# EAGLE design breakout (EAGLE 5.11)
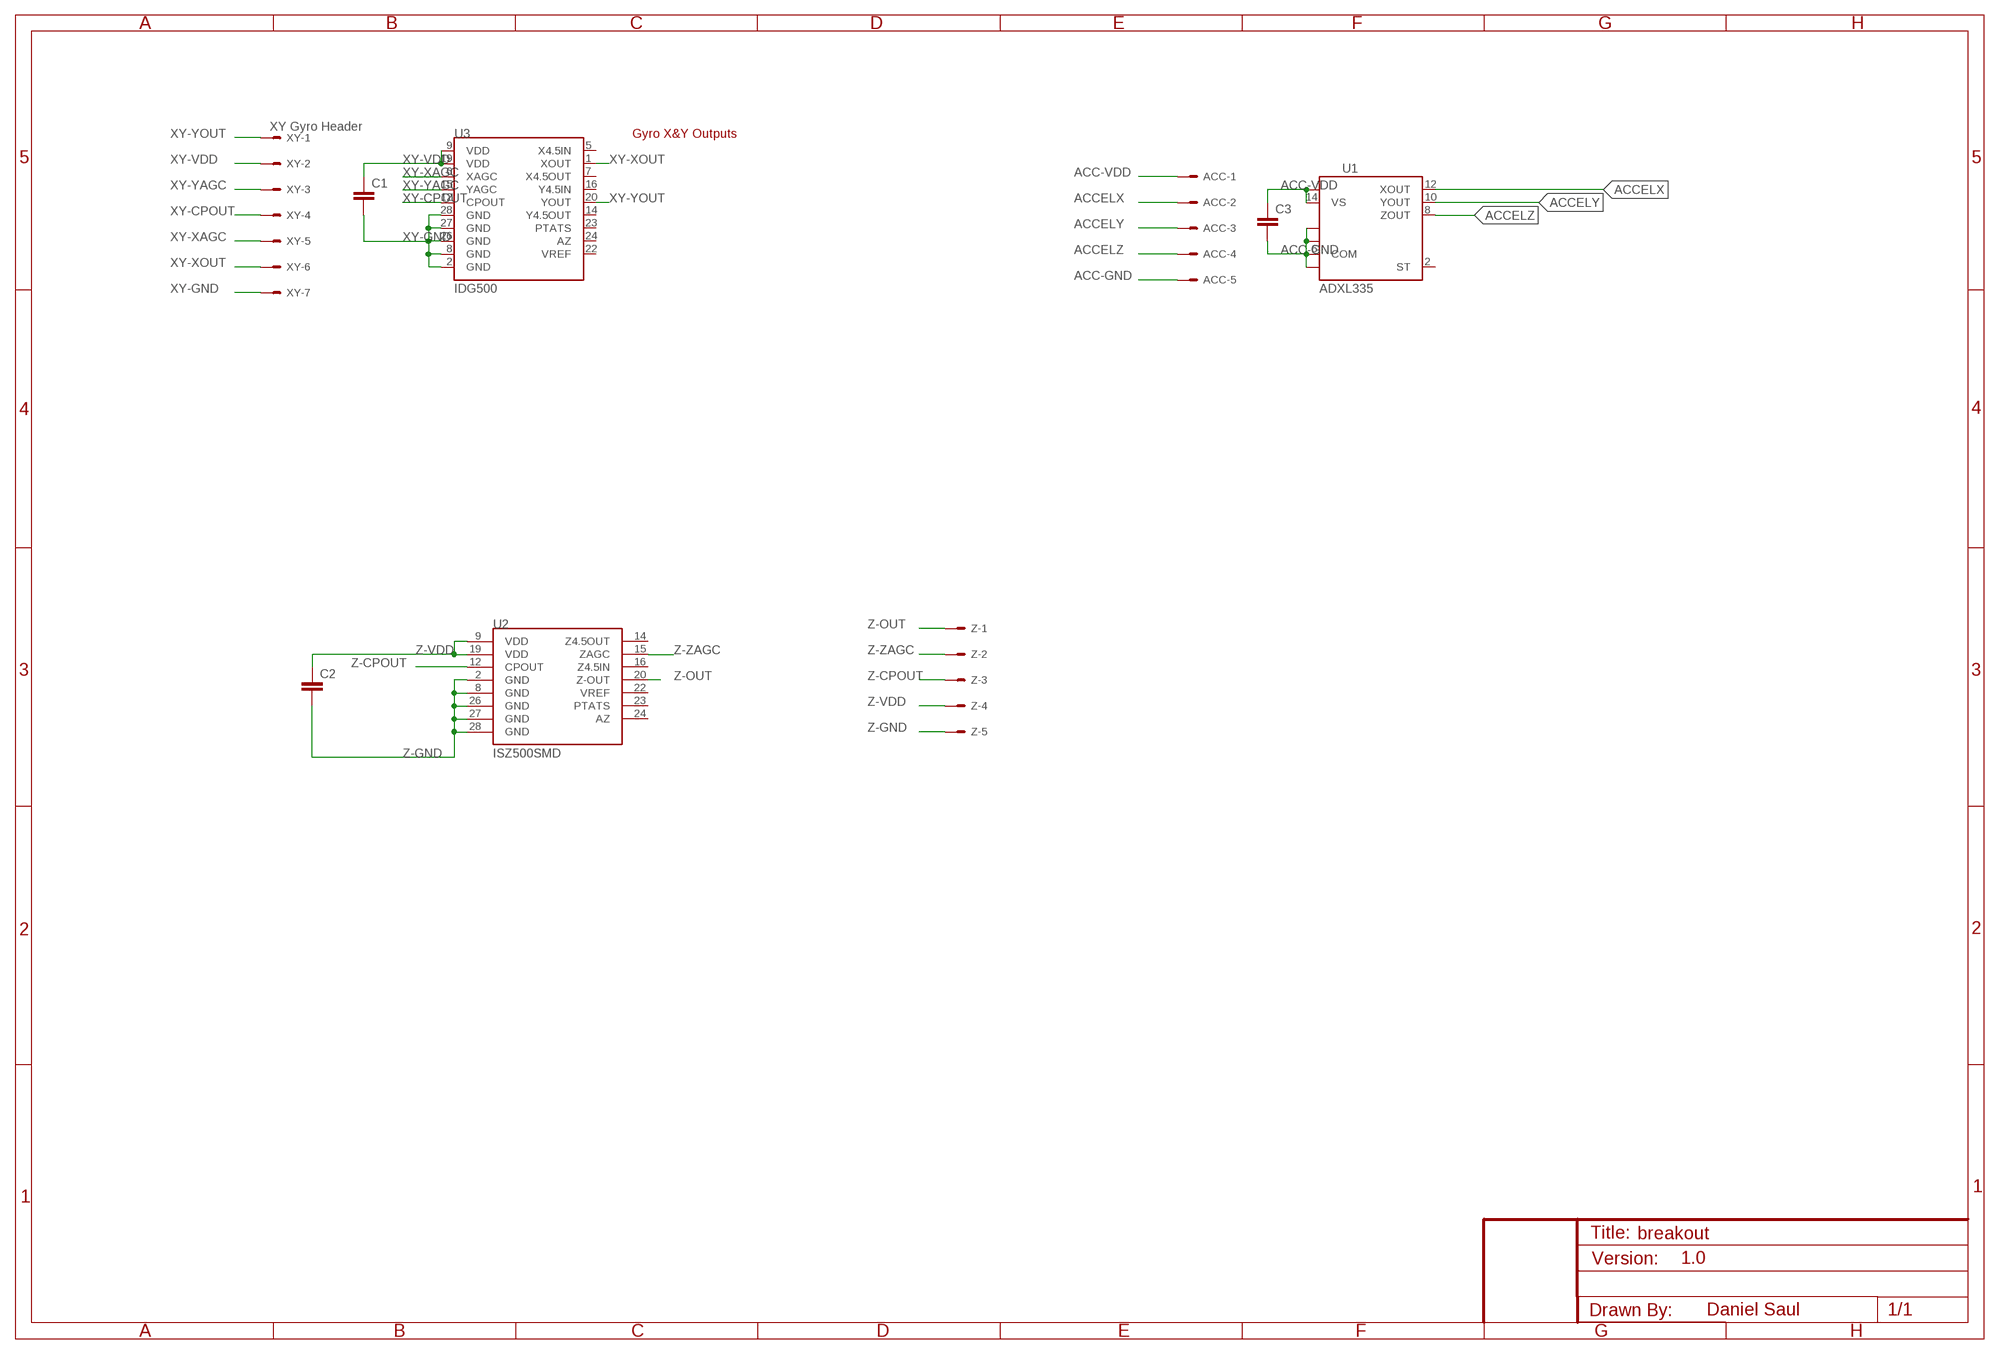
[diagram p0: schematic, sheet 1]

## Parts
ACC  22-27-2051-05  [6410-05]
C1  CAP0805  [0805]
C2  CAP0805  [0805]
C3  CAP0805  [0805]
U1  ADXL335  [LFCSP-16]
U2  ISZ500SMD  [QFN-28_6X8]
U3  IDG500  [SPARKFUN_IDG500]
XY  XY Gyro Header  22-27-2071-07  [6410-07]
Z  22-27-2051-05  [6410-05]

## Nets
ACC-GND: ACC.5 C3.2 U1.3(COM) U1.5(COM) U1.6(COM) U1.7(COM)
ACC-VDD: ACC.1 C3.1 U1.14(VS) U1.15(VS)
ACCELX: ACC.2 U1.12(XOUT)
ACCELY: ACC.3 U1.10(YOUT)
ACCELZ: ACC.4 U1.8(ZOUT)
XY-CPOUT: U3.12(CPOUT) XY.4
XY-GND: C1.2 U3.2(GND) U3.8(GND) U3.26(GND) U3.27(GND) U3.28(GND) XY.7
XY-VDD: C1.1 U3.9(VDD) U3.19(VDD) XY.2
XY-XAGC: U3.6(XAGC) XY.5
XY-XOUT: U3.1(XOUT) XY.6
XY-YAGC: U3.15(YAGC) XY.3
XY-YOUT: U3.20(YOUT) XY.1
Z-CPOUT: U2.12(CPOUT) Z.3
Z-GND: C2.2 U2.2(GND) U2.8(GND) U2.26(GND) U2.27(GND) U2.28(GND) Z.5
Z-OUT: U2.20(Z-OUT) Z.1
Z-VDD: C2.1 U2.9(VDD) U2.19(VDD) Z.4
Z-ZAGC: U2.15(ZAGC) Z.2
Unconnected: U1.2(ST) U2.14(Z4.5OUT) U2.16(Z4.5IN) U2.22(VREF) U2.23(PTATS) U2.24(AZ) U3.5(X4.5IN) U3.7(X4.5OUT) U3.14(Y4.5OUT) U3.16(Y4.5IN) U3.22(VREF) U3.23(PTATS) U3.24(AZ)

## Notes on the sheet
- Gyro X&Y Outputs
- 1.0
- Daniel Saul

## Library data of the parts
ACC Z = con-molex:22-?-05: CONNECTOR wire to board 2.54 mm (.1 inch) pitch header; OC_FARNELL: unknown; OC_NEWARK: unknown
C1-C3 = SparkFun:CAP: Capacitor Standard 0603 ceramic capacitor, and 0.1" leaded capacitor.
U1 = SparkFun:ADXL335
U2 = SparkFun:ISZ500: ISZ500 Single axis gyro
U3 = SparkFun:IDG500
XY = con-molex:22-?-07: CONNECTOR wire to board 2.54 mm (.1 inch) pitch header; OC_FARNELL: unknown; OC_NEWARK: unknown

## Board
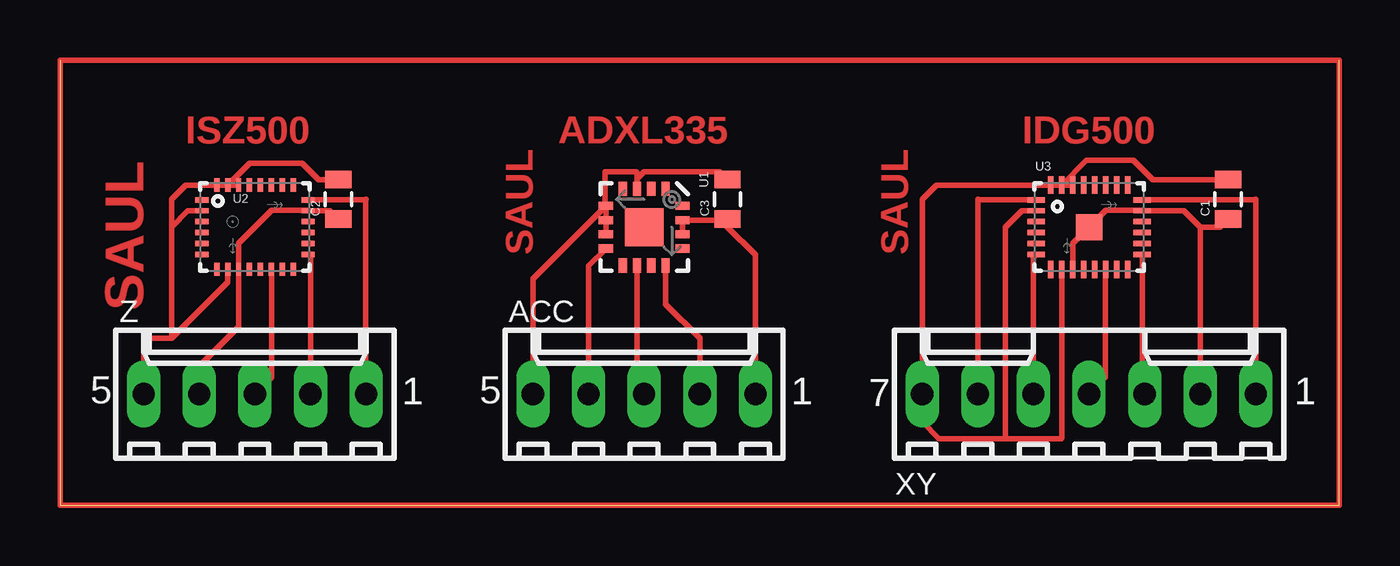
[diagram p1: board, top side]

Size 58.42 x 20.32 mm. Coordinates in mm from the lower left corner, seen from the top.
Outline: 58.42,20.32 58.42,0 0,0 0,20.32
Copper layers (1*16): Top 0.035mm / dielectric 1.5mm / Bottom 0.035mm
Design rules "Fusion_eagle_rule_v1.1 *": minimum track width 10mil, minimum drill 12mil, track to track 10mil, track to pad 6mil, pad to pad 6mil, via to via 6mil, smd to smd 0mil, copper to edge 10mil, drill to drill 10mil, minimum pad ring 10mil, minimum via ring 6mil, stop-mask expansion 2mil, vias tented up to drill 100mil, thermal gap 10mil

### Footprints (pad centres in the part's own frame; a part is rotated, then mirrored left to right if it is on the bottom)
6410-05 = drill 1.016 long: 1 5.08,0; 2 2.54,0; 3 0,0; 4 -2.54,0; 5 -5.08,0
0805 = smd 0.8 x 1.2: 1 -0.9,0; 2 0.9,0
LFCSP-16 = smd 1.75 x 1.75: 0 0,0 | smd 0.65 x 0.37: 1 -1.75,0.975; 2 -1.75,0.325; 3 -1.75,-0.325; 4 -1.75,-0.975; 9 1.75,-0.975; 10 1.75,-0.325; 11 1.75,0.325; 12 1.75,0.975 | smd 0.37 x 0.65: 5 -0.975,-1.75; 6 -0.325,-1.75; 7 0.325,-1.75; 8 0.975,-1.75; 13 0.975,1.75; 14 0.325,1.75; 15 -0.325,1.75; 16 -0.975,1.75
QFN-28_6X8 = smd 0.6 x 0.25: 1 -2.417,1.25; 2 -2.417,0.75; 3 -2.417,0.25; 4 -2.417,-0.25; 5 -2.417,-0.75; 6 -2.417,-1.25; 15 2.433,-1.25; 16 2.433,-0.75; 17 2.433,-0.25; 18 2.433,0.25; 19 2.433,0.75; 20 2.433,1.25 | smd 0.25 x 0.6: 7 -1.742,-1.925; 8 -1.242,-1.925; 9 -0.742,-1.925; 10 -0.242,-1.925; 11 0.258,-1.925; 12 0.758,-1.925; 13 1.258,-1.925; 14 1.758,-1.925; 21 1.758,1.925; 22 1.258,1.925; 23 0.758,1.925; 24 0.258,1.925; 25 -0.242,1.925; 26 -0.742,1.925; 27 -1.242,1.925; 28 -1.742,1.925
SPARKFUN_IDG500 = smd 0.8 x 0.25: 1 -2.417,1.25; 2 -2.417,0.75; 3 -2.417,0.25; 4 -2.417,-0.25; 5 -2.417,-0.75; 6 -2.417,-1.25; 15 2.433,-1.25; 16 2.433,-0.75; 17 2.433,-0.25; 18 2.433,0.25; 19 2.433,0.75; 20 2.433,1.25 | smd 0.25 x 0.8: 7 -1.742,-1.925; 8 -1.242,-1.925; 9 -0.742,-1.925; 10 -0.242,-1.925; 11 0.258,-1.925; 12 0.758,-1.925; 13 1.258,-1.925; 14 1.758,-1.925; 21 1.758,1.925; 22 1.258,1.925; 23 0.758,1.925; 24 0.258,1.925; 25 -0.242,1.925; 26 -0.742,1.925; 27 -1.242,1.925; 28 -1.742,1.925 | smd 1.2 x 1.2: NC 0,0
6410-07 = drill 1.016 long: 1 7.62,0; 2 5.08,0; 3 2.54,0; 4 0,0; 5 -2.54,0; 6 -5.08,0; 7 -7.62,0

### Placement (x,y rotation side)
ACC  26.67,5.08 0 top
C1  53.34,13.97 90 top
C2  12.7,13.97 90 top
C3  30.48,13.97 90 top
U1  26.67,12.7 270 top
U2  8.89,12.7 0 top
U3  46.99,12.7 0 top
XY  46.99,5.08 0 top
Z  8.89,5.08 0 top

### Tracks (layer width: path | path; a pad name or v marks a point on that pad's centre or on a via)
ACC-GND
  Top 0.254: ACC.5 21.59,10.35 U1.5 | U1.7 U1.6 U1.5 | U1.5 24.89,13.7 24.89,15.24 26.29,15.24 26.34,15.18 U1.3 26.34,14.91 26.67,15.24 30.11,15.24 C3.2
ACC-VDD
  Top 0.254: U1.14 U1.15 30.16,13.03 30.48,12.7 | 30.48,12.7 31.75,11.43 ACC.1 | C3.1 30.85,13.07 30.48,12.7
ACCELX
  Top 0.254: U1.12 27.64,9.19 29.21,7.62 ACC.2
ACCELY
  Top 0.254: U1.10 26.34,5.41 ACC.3
ACCELZ
  Top 0.254: ACC.4 24.13,10.94 U1.8
N$2
  Top 0.254: 0,20.32 58.42,20.32 58.42,0 0,0 0,20.32
XY-CPOUT
  Top 0.254: U3.12 47.75,5.84 XY.4
XY-GND
  Top 0.254: U3.27 U3.26 | U3.27 U3.28 40.02,14.62 39.37,13.97 XY.7 39.37,3.81 40.13,3.05 43.18,3.05 | U3.2 43.93,13.45 43.18,12.7 43.18,3.05 | U3.8 45.75,3.08 45.72,3.05 43.18,3.05 | C1.2 49.9,14.87 49.02,15.75 46.87,15.75 U3.27
XY-VDD
  Top 0.254: XY.2 52.07,12.7 | U3.9 46.25,11.96 47.75,13.46 49.41,13.46 U3.19 51.32,13.45 52.07,12.7 | 52.07,12.7 52.97,12.7 C1.1
XY-XAGC
  Top 0.254: XY.5 44.45,11.33 U3.6
XY-XOUT
  Top 0.254: U3.1 41.93,13.95 41.91,13.97 XY.6
XY-YAGC
  Top 0.254: U3.15 49.42,5.19 XY.3
XY-YOUT
  Top 0.254: U3.20 54.59,13.95 54.61,13.97 XY.1
Z-CPOUT
  Top 0.254: U2.12 9.65,5.84 Z.3
Z-GND
  Top 0.254: U2.8 7.65,10.19 5.08,7.62 | 5.08,7.62 3.81,7.62 Z.5 | U2.2 5.83,13.45 5.08,12.7 | 5.08,7.62 5.08,12.7 | U2.27 U2.26 | U2.27 U2.28 5.74,14.62 5.08,13.97 5.08,12.7 | C2.2 11.8,14.87 11.05,15.62 8.64,15.62 U2.27
Z-OUT
  Top 0.254: 13.95,13.95 U2.20 | 13.95,13.95 13.97,13.97 | 13.95,13.95 13.95,5.1 Z.1
Z-VDD
  Top 0.254: Z.4 6.35,6.35 8.15,8.15 U2.9 8.15,11.96 9.65,13.46 11.31,13.46 U2.19 12.32,13.45 C2.1
Z-ZAGC
  Top 0.254: U2.15 11.41,11.45 11.43,11.43 Z.2

### Text on the board
Top: ISZ500 | ADXL335 | IDG500 | SAUL | SAUL | SAUL